# EAGLE design Esp32_Shield V3 no LED (EAGLE 9.6.2)
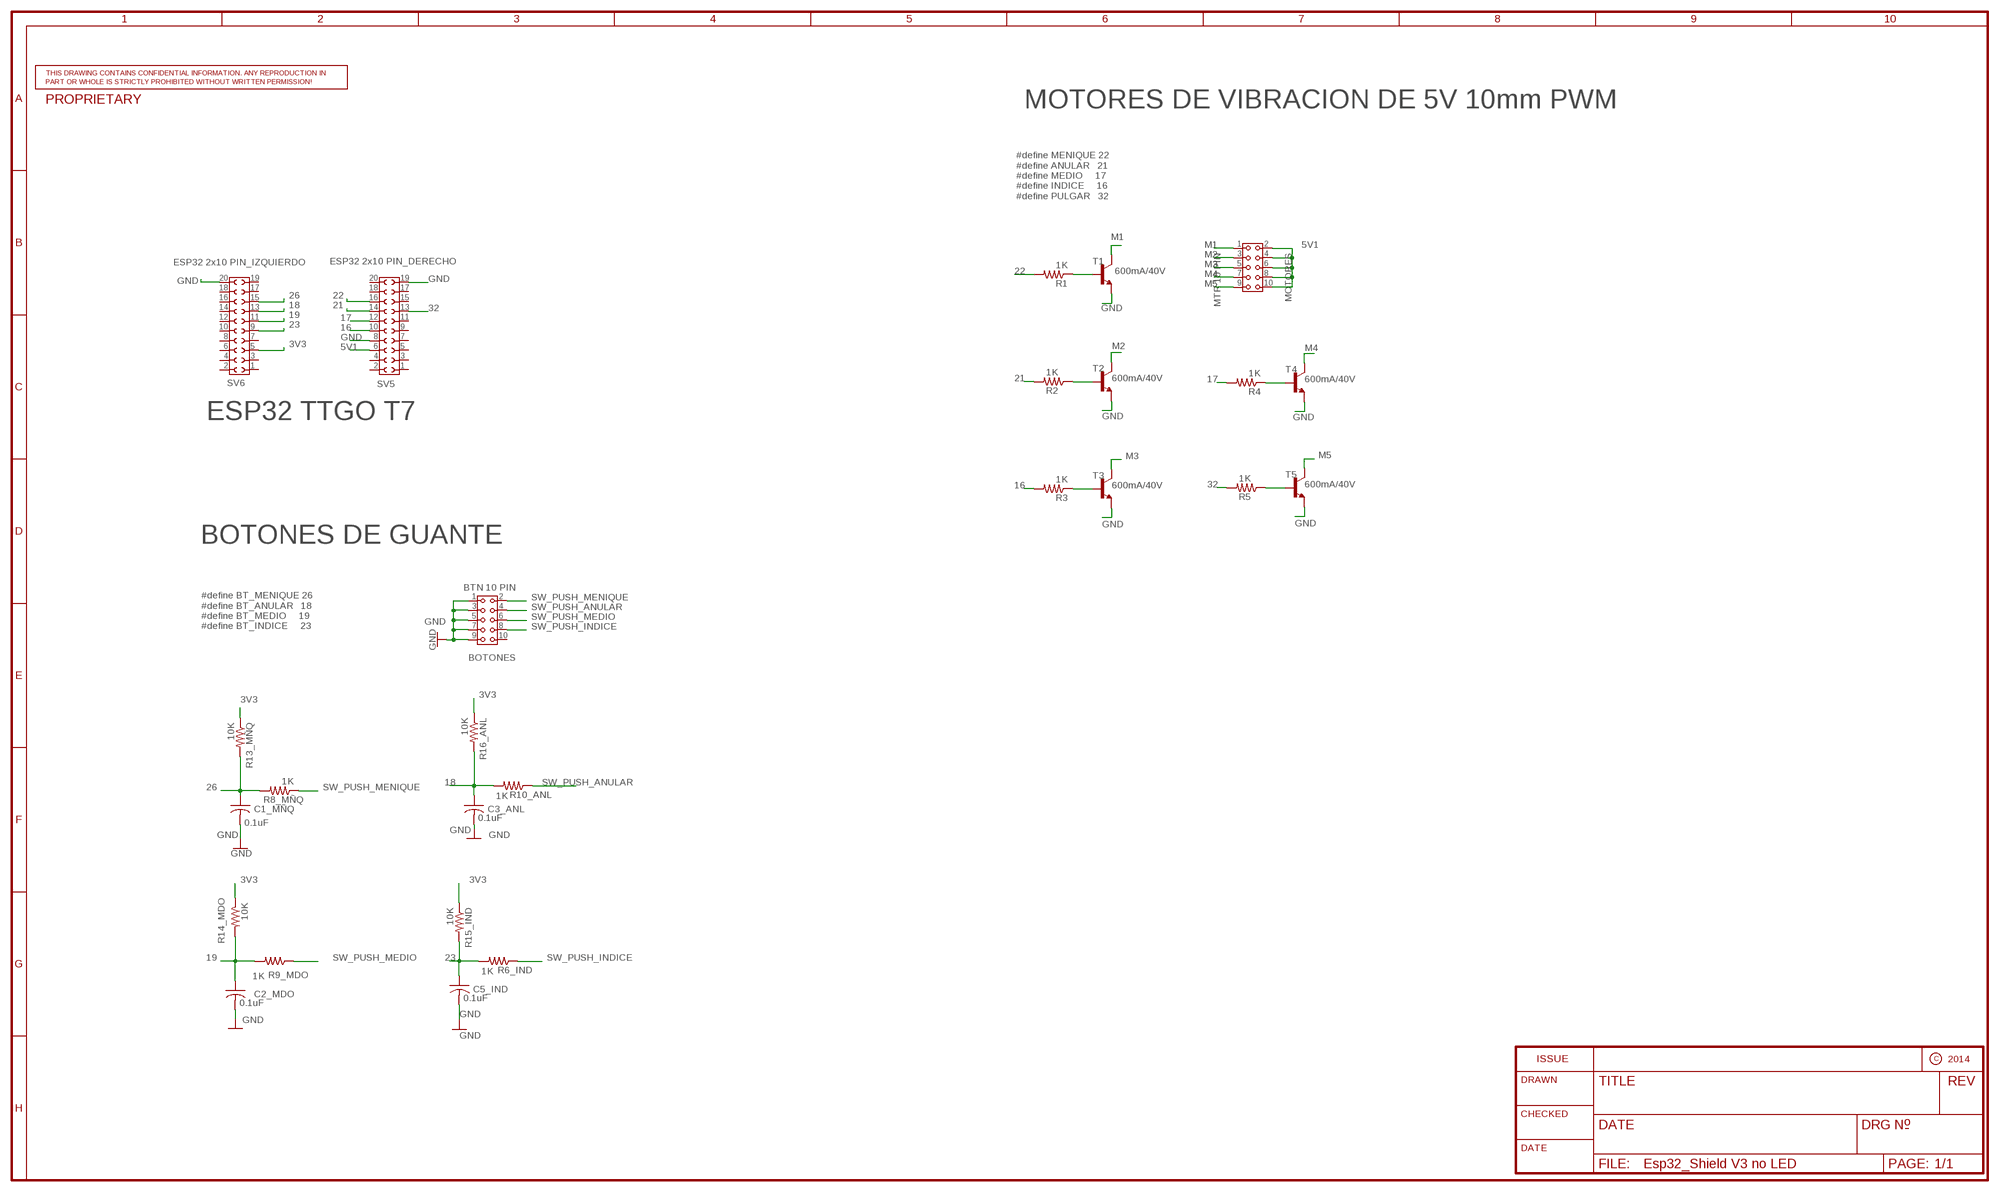
[diagram p0: schematic, sheet 1]

## Parts
BOTONES  BTN 10 PIN  6130XX21821_61301021821  [61301021821]
C1_MÑQ  0.1uF  C-USC0805  [C0805]
C2_MDO  0.1uF  C-USC0805  [C0805]
C3_ANL  0.1uF  C-USC0805  [C0805]
C5_IND  0.1uF  C-USC0805  [C0805]
MOTORES  MTR 10 PIN  6130XX21821_61301021821  [61301021821]
R1  1K  R-US_R0805  [R0805]
R2  1K  R-US_R0805  [R0805]
R3  1K  R-US_R0805  [R0805]
R4  1K  R-US_R0805  [R0805]
R5  1K  R-US_R0805  [R0805]
R6_IND  1K  R-US_R0805  [R0805]
R8_MÑQ  1K  R-US_R0805  [R0805]
R9_MDO  1K  R-US_R0805  [R0805]
R10_ANL  1K  R-US_R0805  [R0805]
R13_MÑQ  10K  R-US_R0805  [R0805]
R14_MDO  10K  R-US_R0805  [R0805]
R15_IND  10K  R-US_R0805  [R0805]
R16_ANL  10K  R-US_R0805  [R0805]
SV5  ESP32 2x10 PIN_DERECHO  6130XX21821_61302021821  [61302021821]
SV6  ESP32 2x10 PIN_IZQUIERDO  6130XX21821_61302021821  [61302021821]
T1  600mA/40V  TRANS_NPN-MMBT2222AL  [SOT23-3]
T2  600mA/40V  TRANS_NPN-MMBT2222AL  [SOT23-3]
T3  600mA/40V  TRANS_NPN-MMBT2222AL  [SOT23-3]
T4  600mA/40V  TRANS_NPN-MMBT2222AL  [SOT23-3]
T5  600mA/40V  TRANS_NPN-MMBT2222AL  [SOT23-3]

## Nets
3V3: R13_MÑQ.1 R14_MDO.1 R15_IND.1 R16_ANL.1 SV6.5
5V1: MOTORES.2 MOTORES.4 MOTORES.6 MOTORES.8 MOTORES.10 SV5.6
16: R3.2 SV5.10
17: R4.2 SV5.12
18: C3_ANL.1 R10_ANL.2 R16_ANL.2 SV6.13
19: C2_MDO.1 R9_MDO.2 R14_MDO.2 SV6.11
21: R2.2 SV5.14
22: R1.2 SV5.16
23: C5_IND.1 R6_IND.2 R15_IND.2 SV6.9
26: C1_MÑQ.1 R8_MÑQ.2 R13_MÑQ.2 SV6.15
32: R5.2 SV5.13
GND: BOTONES.1 BOTONES.3 BOTONES.5 BOTONES.7 BOTONES.9 C1_MÑQ.2 C2_MDO.2 C3_ANL.2 C5_IND.2 SV5.8 SV5.19 SV6.20 T1.2(E) T2.2(E) T3.2(E) T4.2(E) T5.2(E)
M1: MOTORES.1 T1.3(C)
M2: MOTORES.3 T2.3(C)
M3: MOTORES.5 T3.3(C)
M4: MOTORES.7 T4.3(C)
M5: MOTORES.9 T5.3(C)
N$1: R2.1 T2.1(B)
N$2: R1.1 T1.1(B)
N$3: R3.1 T3.1(B)
N$11: R4.1 T4.1(B)
N$13: R5.1 T5.1(B)
SW_PUSH_ANULAR: BOTONES.4 R10_ANL.1
SW_PUSH_INDICE: BOTONES.8 R6_IND.1
SW_PUSH_MEDIO: BOTONES.6 R9_MDO.1
SW_PUSH_MENIQUE: BOTONES.2 R8_MÑQ.1
Unconnected: BOTONES.10 SV5.1 SV5.2 SV5.3 SV5.4 SV5.5 SV5.7 SV5.9 SV5.11 SV5.15 SV5.17 SV5.18 SV5.20 SV6.1 SV6.2 SV6.3 SV6.4 SV6.6 SV6.7 SV6.8 SV6.10 SV6.12 SV6.14 SV6.16 SV6.17 SV6.18 SV6.19

## Notes on the sheet
- MOTORES DE VIBRACION DE 5V 10mm PWM
- #define MENIQUE 22
  #define ANULAR   21
  #define MEDIO     17
  #define INDICE     16
  #define PULGAR   32
- ESP32 TTGO T7
- BOTONES DE GUANTE
- #define BT_MENIQUE 26
  #define BT_ANULAR   18
  #define BT_MEDIO     19
  #define BT_INDICE     23

## Library data of the parts
BOTONES MOTORES = Wurth_Connectors_WR-PHD:6130XX21821_61301021821: WR-PHD 2.54 mm Dual Socket Header ARTICLE PROPERTIES: Pins:4;​ 6;​ 8;​ 10;​ 12;​ 14;​ 16;​ 18;​ 20;​ 22;​ 24;​ 26;​ 28;​ 30;​ 32;​ 34;​ 36;​ 40;​ 44;​ 64;​ 72 KIND PROPERTIES: Pitch：2.54 mm Quality Class:3 as per CECC 75 301-802 Rows：Dual Gender：Socket Header Type：Straight MATERIAL PROPERTIES: Insulator Material :PBT Insulator Flammability Rating:UL94 V-0 Contact Material:Copper Alloy Contact Plating:Gold Contact Type:Stamped GENERAL INFORMATION Operating Temperature:-40 up to +125 °C Compliance:Lead free / RoHS ELECTRICAL PROPERTIES: Rated Current:3 A IR 1:3 A Withstanding Voltage:500 V (AC) Contact Resistance:20 mΩ RISO:1000 MΩ CERTIFICATION UL Approval:E323964 PACKAGING PROPERTIES Packaging:Tray <https://katalog.we-online.com/media/images/v2/o57948v209%20Family_Dual_Socket_Header_WR-PHD_6130xx21821.jpg> Details see: https://katalog.we-online.com/en/em/PHD_2_54_DUAL_SOCKET_HEADER_6130XX21821 Updated by Yingchun,Shan 2019-10-21 2019 (C) Würth Elektronik; DATASHEET-URL: https://katalog.we-online.com/em/datasheet/61301021821.pdf; GENDER: Socket Header; IR: 3A; MATES: WR-PHD 2.54mm SMT Dual Pin Header/THT Angled Dual Pin Header/THT Dual Board Stacker/THT Dual Pin Header; PACKAGING: Tray; PART-NUMBER: 61301021821; PINS: 10; ROWS: Dual; TYPE: Straight
C1_MÑQ C2_MDO C3_ANL C5_IND = resistor:C-US: CAPACITOR, American symbol
R1-R5 R6_IND R8_MÑQ R9_MDO R10_ANL R13_MÑQ R14_MDO R15_IND R16_ANL = resistor:R-US_: RESISTOR, American symbol
SV5 SV6 = Wurth_Connectors_WR-PHD:6130XX21821_61302021821: WR-PHD 2.54 mm Dual Socket Header ARTICLE PROPERTIES: Pins:4;​ 6;​ 8;​ 10;​ 12;​ 14;​ 16;​ 18;​ 20;​ 22;​ 24;​ 26;​ 28;​ 30;​ 32;​ 34;​ 36;​ 40;​ 44;​ 64;​ 72 KIND PROPERTIES: Pitch：2.54 mm Quality Class:3 as per CECC 75 301-802 Rows：Dual Gender：Socket Header Type：Straight MATERIAL PROPERTIES: Insulator Material :PBT Insulator Flammability Rating:UL94 V-0 Contact Material:Copper Alloy Contact Plating:Gold Contact Type:Stamped GENERAL INFORMATION Operating Temperature:-40 up to +125 °C Compliance:Lead free / RoHS ELECTRICAL PROPERTIES: Rated Current:3 A IR 1:3 A Withstanding Voltage:500 V (AC) Contact Resistance:20 mΩ RISO:1000 MΩ CERTIFICATION UL Approval:E323964 PACKAGING PROPERTIES Packaging:Tray <https://katalog.we-online.com/media/images/v2/o57948v209%20Family_Dual_Socket_Header_WR-PHD_6130xx21821.jpg> Details see: https://katalog.we-online.com/en/em/PHD_2_54_DUAL_SOCKET_HEADER_6130XX21821 Updated by Yingchun,Shan 2019-10-21 2019 (C) Würth Elektronik; DATASHEET-URL: https://katalog.we-online.com/em/datasheet/61302021821.pdf; GENDER: Socket Header; IR: 3A; MATES: WR-PHD 2.54mm SMT Dual Pin Header/THT Angled Dual Pin Header/THT Dual Board Stacker/THT Dual Pin Header; PACKAGING: Tray; PART-NUMBER: 61302021821; PINS: 20; ROWS: Dual; TYPE: Straight
T1-T5 = SparkFun-DiscreteSemi:TRANS_NPN: NPN transistor Current controlled devices typically used to amplify current or used as a switch. BC547 - COM-08928 <http://www.sparkfun.com/products/8928> (TO-92 45V 100mA) (1.Collector 2.Base 3.Emitter) 2N3904 - COM-00521 <http://www.sparkfun.com/products/521> (TO-92 40V 200mA) (1.Emitter 2.Base 3.Collector) P2N2222A - COM-12852 <http://www.sparkfun.com/products/12852> (TO-92 40V 600mA) (1.Collector 2.Base 3.Emitter); PROD_ID: TRANS-08049

## Board
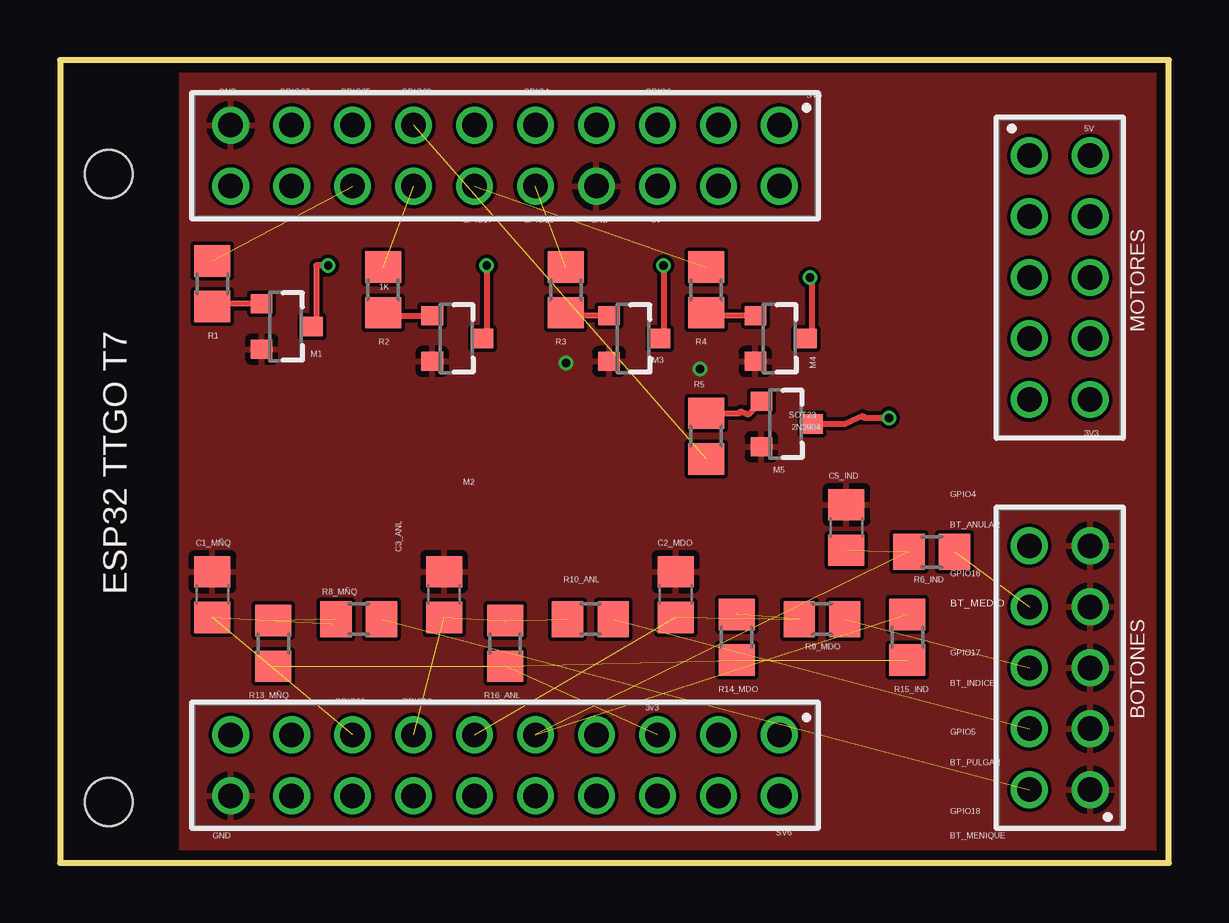
[diagram p1: board, top side]
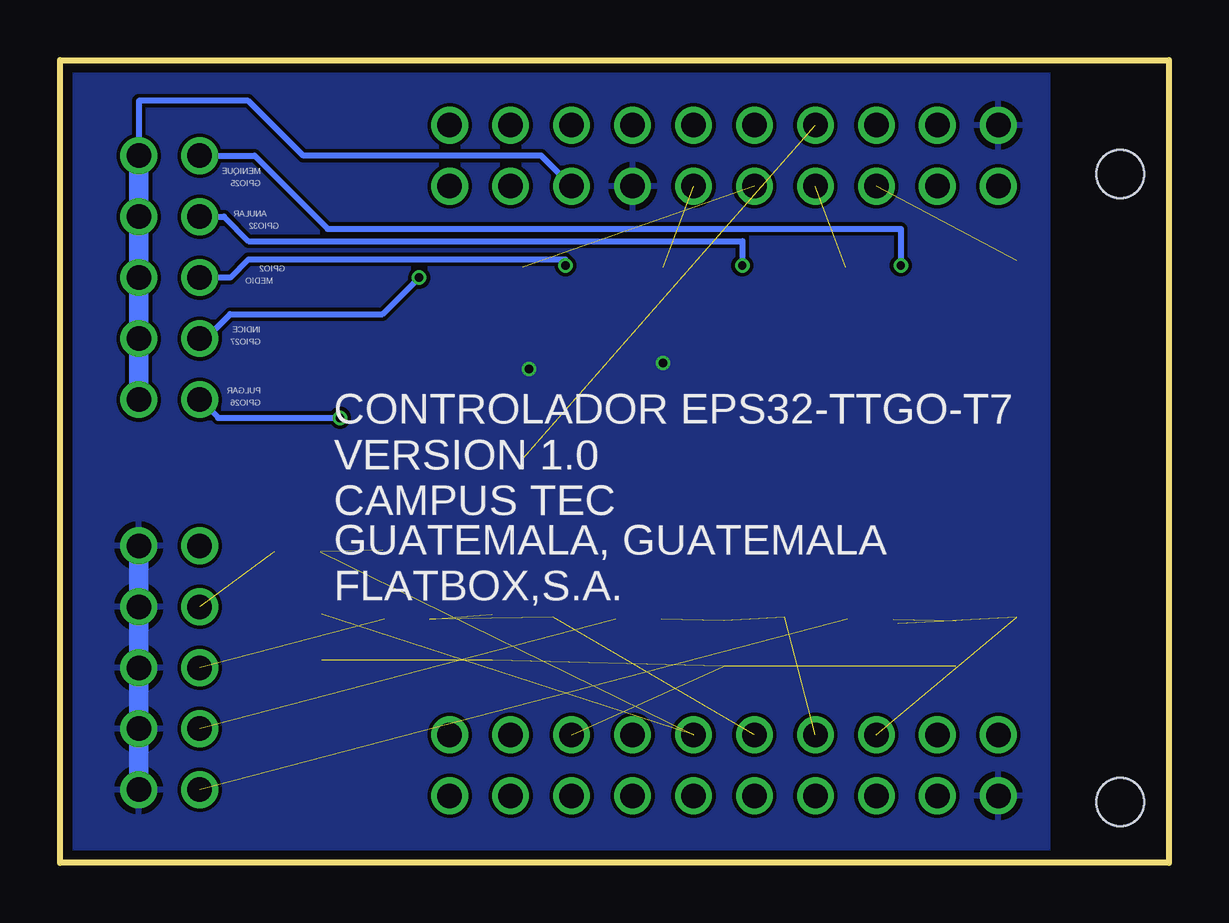
[diagram p2: board, bottom side, seen from below]

Size 46.21 x 33.45 mm. Coordinates in mm from the lower left corner, seen from the top.
Outline: 0,0 46.21,0 46.21,33.45 0,33.45 0,0
Copper layers (1*16): Top 0.035559375mm / dielectric 1.6mm / Bottom 0.035559375mm
Design rules "oshpark-2layer": minimum track width 6mil, minimum drill 10mil, track to track 6mil, track to pad 6mil, pad to pad 6mil, via to via 6mil, smd to smd 6mil, copper to edge 15mil, drill to drill 6mil, minimum pad ring 5mil, minimum via ring 5mil, stop-mask expansion 2.5mil, vias tented up to drill 0mil, thermal gap 10mil
Holes 2 mm at 2.03,28.7 2.03,2.54

### Footprints (pad centres in the part's own frame; a part is rotated, then mirrored left to right if it is on the bottom)
61301021821 = drill 1.02: 1 -5.08,-1.27; 2 -5.08,1.27; 3 -2.54,-1.27; 4 -2.54,1.27; 5 0,-1.27; 6 0,1.27; 7 2.54,-1.27; 8 2.54,1.27; 9 5.08,-1.27; 10 5.08,1.27
C0805 = smd 1.3 x 1.5: 1 -0.95,0; 2 0.95,0
R0805 = smd 1.3 x 1.5: 1 -0.95,0; 2 0.95,0
61302021821 = drill 1.02: 1 -11.43,-1.27; 2 -11.43,1.27; 3 -8.89,-1.27; 4 -8.89,1.27; 5 -6.35,-1.27; 6 -6.35,1.27; 7 -3.81,-1.27; 8 -3.81,1.27; 9 -1.27,-1.27; 10 -1.27,1.27; 11 1.27,-1.27; 12 1.27,1.27; 13 3.81,-1.27; 14 3.81,1.27; 15 6.35,-1.27; 16 6.35,1.27; 17 8.89,-1.27; 18 8.89,1.27; 19 11.43,-1.27; 20 11.43,1.27
SOT23-3 = smd 0.8 x 0.9: 1 -0.95,-1; 2 0.95,-1; 3 0,1.1

### Placement (x,y rotation side)
BOTONES  41.66,8.13 90 top
C1_MÑQ  6.35,11.18 90 top
C2_MDO  25.65,11.18 90 top
C3_ANL  16,11.18 90 top
C5_IND  32.77,13.97 90 top
MOTORES  41.66,24.38 270 top
R1  6.35,24.13 90 top
R2  13.46,23.88 90 top
R3  21.08,23.88 90 top
R4  26.92,23.88 90 top
R5  26.92,17.78 270 top
R6_IND  36.32,12.95 180 top
R8_MÑQ  12.45,10.16 180 top
R9_MDO  31.75,10.16 180 top
R10_ANL  22.1,10.16 180 top
R13_MÑQ  8.89,9.14 90 top
R14_MDO  28.19,9.4 90 top
R15_IND  35.31,9.4 90 top
R16_ANL  18.54,9.14 90 top
SV5  18.54,29.46 180 top
SV6  18.54,4.06 180 top
T1  9.4,22.35 270 top
T2  16.51,21.84 270 top
T3  23.88,21.84 270 top
T4  29.97,21.84 270 top
T5  30.23,18.29 270 top

### Tracks (layer width: path | path; a pad name or v marks a point on that pad's centre or on a via)
3V3  (4 unrouted)
5V1
  Bottom 0.254: SV5.6 26.16,29.46 36.07,29.46 38.35,31.75 42.93,31.75 MOTORES.2
  Bottom 0.813: MOTORES.2 MOTORES.4 MOTORES.6 MOTORES.8 MOTORES.10
16  (1 unrouted)
17  (1 unrouted)
18  (3 unrouted)
19  (3 unrouted)
21  (1 unrouted)
22  (1 unrouted)
23  (3 unrouted)
26  (3 unrouted)
  Top 0.254: 11.31,9.97 R8_MÑQ.2
32  (1 unrouted)
  Top 0.254: R5.2 27.24,16.51
GND  (via drill 0.35)
  Bottom 0.813: BOTONES.9 BOTONES.7 BOTONES.5 BOTONES.3 BOTONES.1
  other vias: 21.08,20.83 26.67,20.57
  pour Top: 5.08,34.54 5.08,-0.51 47.75,-0.51 47.75,34.54
  pour Bottom: 5.08,34.54 5.08,-1.02 47.24,-1.02 47.24,34.54
M1  (via drill 0.35)
  Top 0.254: T1.3 10.67,22.52 10.67,24.89 v11.18,24.89
  Bottom 0.254: MOTORES.1 38.1,29.46 35.05,26.42 11.18,26.42 v11.18,24.89
M2  (via drill 0.35)
  Top 0.254: v17.78,24.89 17.78,22.01 T2.3
  Bottom 0.254: MOTORES.3 39.37,26.92 38.35,25.91 17.78,25.91 v17.78,24.89
M3  (via drill 0.35)
  Top 0.254: v25.15,24.89 25.15,22.01 T3.3
  Bottom 0.254: v25.15,24.89 25.15,25.15 38.35,25.15 39.12,24.38 MOTORES.5
M4  (via drill 0.35)
  Top 0.254: v31.24,24.38 31.33,24.3 31.33,22.1 T4.3
  Bottom 0.254: MOTORES.7 40.13,21.84 39.12,22.86 32.77,22.86 v31.24,24.38
M5  (via drill 0.35)
  Top 0.254: T5.3 32.71,18.29 33.44,18.63 33.53,18.54 v34.54,18.54
  Bottom 0.254: v34.54,18.54 39.62,18.54 MOTORES.9
N$1
  Top 0.254: R2.1 13.59,22.79 T2.1
N$2
  Top 0.254: R1.1 6.47,23.3 T1.1
N$3
  Top 0.254: T3.1 21.21,22.79 R3.1
N$11
  Top 0.254: R4.1 27.06,22.79 T4.1
N$13
  Top 0.254: R5.1 28.28,18.73 28.37,18.81 28.67,18.68 T5.1
SW_PUSH_ANULAR  (1 unrouted)
SW_PUSH_INDICE  (1 unrouted)
SW_PUSH_MEDIO  (1 unrouted)
SW_PUSH_MENIQUE  (1 unrouted)

### Text on the board
tNames: GND | GPIO27 | GPIO25 | GPIO32 | GPIO4 | GPIO2 | 5V | GPIO17 | GPIO16 | GND | 5V | 1K | M1 | M3 | M4 | SOT23 | 2N3904 | 3V3 | M2 | M5 | GPIO4 | BT_ANULAR | GPIO16 | ESP32 TTGO T7 | BT_MEDIO | GPIO17 | GPIO26 | GPIO18 | BT_INDICE | 3v3 | GPIO5 | BT_PULGAR | GPIO18 | GND | BT_MENIQUE
bNames: GPIO25 | MENIQUE | ANULAR | GPIO32 | GPIO2 | MEDIO | INDICE | GPIO27 | GPIO26 | PULGAR | CONTROLADOR EPS32-TTGO-T7 / VERSION 1.0 / CAMPUS TEC | FLATBOX,S.A. | GUATEMALA, GUATEMALA